# Altium schematic sheet DE-110817_02.SchDoc: Digital & Analog IO
size A3; Author: eldar6776@hotmail.com; DrawnBy: Eldar Dedic; Organization: I-MEDIA GROUP d.o.o.; Address1: Topal Osman Paše 18; Address2: 71000 Sarajevo; Address3: Federacija BiH; Address4: Bosna i Hercegovina; DocumentNumber: DE-110717; Revision: 001
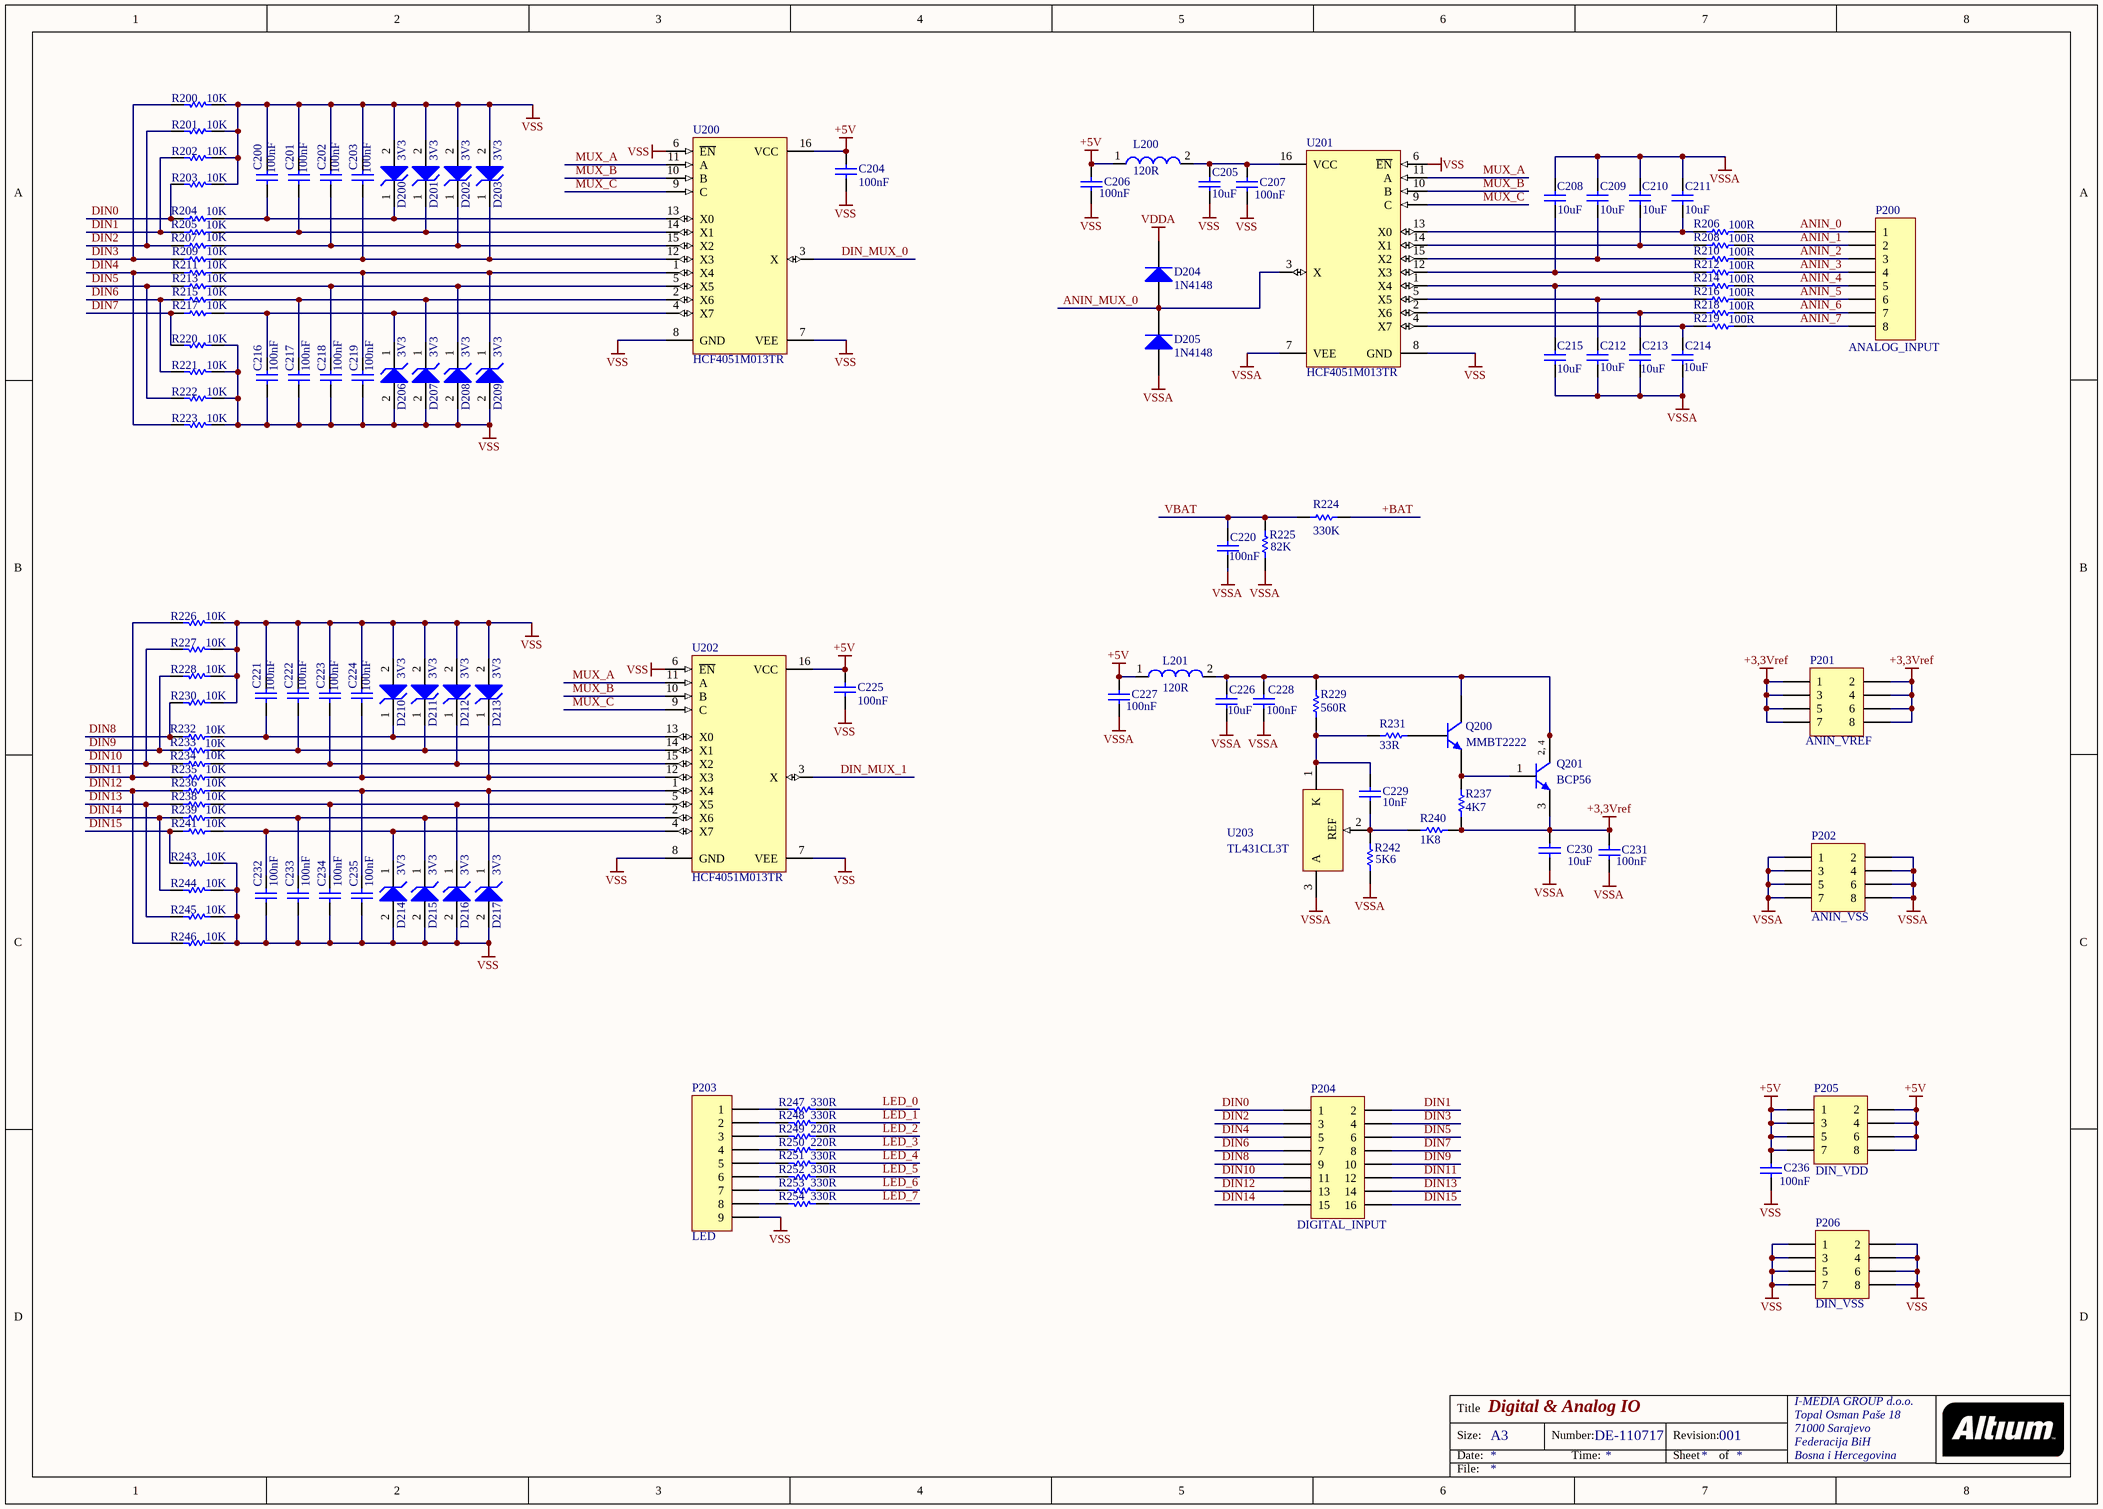
[diagram p0: DE-110817_02.SchDoc]

## Parts
C200  100nF  [0603]
C201  100nF  [0603]
C202  100nF  [0603]
C203  100nF  [0603]
C204  100nF  [0603]
C205  10uF  [0805]
C206  100nF  [0603]
C207  100nF  [0603]
C208  10uF  [0805]
C209  10uF  [0805]
C210  10uF  [0805]
C211  10uF  [0805]
C212  10uF  [0805]
C213  10uF  [0805]
C214  10uF  [0805]
C215  10uF  [0805]
C216  100nF  [0603]
C217  100nF  [0603]
C218  100nF  [0603]
C219  100nF  [0603]
C220  100nF  [0603]
C221  100nF  [0603]
C222  100nF  [0603]
C223  100nF  [0603]
C224  100nF  [0603]
C225  100nF  [0603]
C226  10uF  [0805]
C227  100nF  [0603]
C228  100nF  [0603]
C229  10nF  [0603]
C230  10uF  [0805]
C231  100nF  [0603]
C232  100nF  [0603]
C233  100nF  [0603]
C234  100nF  [0603]
C235  100nF  [0603]
C236  100nF  [0603]
D200  3V3  [ONSC-SOD-323-2-477-02_V]
D201  3V3  [ONSC-SOD-323-2-477-02_V]
D202  3V3  [ONSC-SOD-323-2-477-02_V]
D203  3V3  [ONSC-SOD-323-2-477-02_V]
D204  1N4148  [SOD323]
D205  1N4148  [SOD323]
D206  3V3  [ONSC-SOD-323-2-477-02_V]
D207  3V3  [ONSC-SOD-323-2-477-02_V]
D208  3V3  [ONSC-SOD-323-2-477-02_V]
D209  3V3  [ONSC-SOD-323-2-477-02_V]
D210  3V3  [ONSC-SOD-323-2-477-02_V]
D211  3V3  [ONSC-SOD-323-2-477-02_V]
D212  3V3  [ONSC-SOD-323-2-477-02_V]
D213  3V3  [ONSC-SOD-323-2-477-02_V]
D214  3V3  [ONSC-SOD-323-2-477-02_V]
D215  3V3  [ONSC-SOD-323-2-477-02_V]
D216  3V3  [ONSC-SOD-323-2-477-02_V]
D217  3V3  [ONSC-SOD-323-2-477-02_V]
L200  120R  [SMD-0805]
L201  120R  [SMD-0805]
P200  ANALOG_INPUT  [HDR1X8]
P201  ANIN_VREF  [HDR2X4]
P202  ANIN_VSS  [HDR2X4]
P203  LED  [HDR1X9]
P204  DIGITAL_INPUT  [HDR2X8]
P205  DIN_VDD  [HDR2X4]
P206  DIN_VSS  [HDR2X4]
Q200  MMBT2222  [318-08]
Q201  BCP56  [SOT223_N]
R200  10K  [ERA-0603]
R201  10K  [ERA-0603]
R202  10K  [ERA-0603]
R203  10K  [ERA-0603]
R204  10K  [ERA-0603]
R205  10K  [ERA-0603]
R206  100R  [ERA-0603]
R207  10K  [ERA-0603]
R208  100R  [ERA-0603]
R209  10K  [ERA-0603]
R210  100R  [ERA-0603]
R211  10K  [ERA-0603]
R212  100R  [ERA-0603]
R213  10K  [ERA-0603]
R214  100R  [ERA-0603]
R215  10K  [ERA-0603]
R216  100R  [ERA-0603]
R217  10K  [ERA-0603]
R218  100R  [ERA-0603]
R219  100R  [ERA-0603]
R220  10K  [ERA-0603]
R221  10K  [ERA-0603]
R222  10K  [ERA-0603]
R223  10K  [ERA-0603]
R224  330K  [ERA-0603]
R225  82K  [ERA-0603]
R226  10K  [ERA-0603]
R227  10K  [ERA-0603]
R228  10K  [ERA-0603]
R229  560R  [ERA-0603]
R230  10K  [ERA-0603]
R231  33R  [ERA-0603]
R232  10K  [ERA-0603]
R233  10K  [ERA-0603]
R234  10K  [ERA-0603]
R235  10K  [ERA-0603]
R236  10K  [ERA-0603]
R237  4K7  [ERA-0603]
R238  10K  [ERA-0603]
R239  10K  [ERA-0603]
R240  1K8  [ERA-0603]
R241  10K  [ERA-0603]
R242  5K6  [ERA-0603]
R243  10K  [ERA-0603]
R244  10K  [ERA-0603]
R245  10K  [ERA-0603]
R246  10K  [ERA-0603]
R247  330R  [ERA-0603]
R248  330R  [ERA-0603]
R249  220R  [ERA-0603]
R250  220R  [ERA-0603]
R251  330R  [ERA-0603]
R252  330R  [ERA-0603]
R253  330R  [ERA-0603]
R254  330R  [ERA-0603]
U200  HCF4051M013TR  [M16A_N]
U201  HCF4051M013TR  [M16A_N]
U202  HCF4051M013TR  [M16A_N]
U203  TL431CL3T  [SOT23-3_N]

## Nets
+3,3Vref: C230.2 C231.2 P201.1 P201.2 P201.3 P201.4 P201.5 P201.6 P201.7 P201.8 Q201.3(E) R237.2 R240.2
+5V: C204.2 C206.2 C225.2 C227.2 C236.2 L200.1 L201.1 P205.1 P205.2 P205.3 P205.4 P205.5 P205.6 P205.7 P205.8 U200.16(VCC) U202.16(VCC)
VDDA: D204.1(K)
VSS: C200.1 C201.1 C202.1 C203.1 C204.1 C205.1 C206.1 C207.1 C216.1 C217.1 C218.1 C219.1 C221.1 C222.1 C223.1 C224.1 C225.1 C232.1 C233.1 C234.1 C235.1 C236.1 D200.2(A) D201.2(A) D202.2(A) D203.2(A) D206.2(A) D207.2(A) D208.2(A) D209.2(A) D210.2(A) D211.2(A) D212.2(A) D213.2(A) D214.2(A) D215.2(A) D216.2(A) D217.2(A) P203.9 P206.1 P206.2 P206.3 P206.4 P206.5 P206.6 P206.7 P206.8 R200.1 R201.1 R202.1 R203.1 R220.1 R221.1 R222.1 R223.1 R226.1 R227.1 R228.1 R230.1 R243.1 R244.1 R245.1 R246.1 U200.6(~{EN}) U200.7(VEE) U200.8(GND) U201.6(~{EN}) U201.8(GND) U202.6(~{EN}) U202.7(VEE) U202.8(GND)
VSSA: C208.1 C209.1 C210.1 C211.1 C212.1 C213.1 C214.1 C215.1 C220.1 C226.1 C227.1 C228.1 C230.1 C231.1 D205.2(A) P202.1 P202.2 P202.3 P202.4 P202.5 P202.6 P202.7 P202.8 R225.1 R242.2 U201.7(VEE) U203.3(A)
+BAT: R224.2
ANIN_0: P200.1 R206.2
ANIN_1: P200.2 R208.2
ANIN_2: P200.3 R210.2
ANIN_3: P200.4 R212.2
ANIN_4: P200.5 R214.2
ANIN_5: P200.6 R216.2
ANIN_6: P200.7 R218.2
ANIN_7: P200.8 R219.2
ANIN_MUX_0: D204.2(A) D205.1(K) U201.3(X)
DIN0: P204.1 R203.2 R204.1
DIN1: P204.2 R202.2 R205.1
DIN2: P204.3 R201.2 R207.1
DIN3: P204.4 R200.2 R209.1
DIN4: P204.5 R211.1 R223.2
DIN5: P204.6 R213.1 R222.2
DIN6: P204.7 R215.1 R221.2
DIN7: P204.8 R217.1 R220.2
DIN8: P204.9 R230.2 R232.1
DIN9: P204.10 R228.2 R233.1
DIN10: P204.11 R227.2 R234.1
DIN11: P204.12 R226.2 R235.1
DIN12: P204.13 R236.1 R246.2
DIN13: P204.14 R238.1 R245.2
DIN14: P204.15 R239.1 R244.2
DIN15: P204.16 R241.1 R243.2
DIN_MUX_0: U200.3(X)
DIN_MUX_1: U202.3(X)
LED_0: R247.2
LED_1: R248.2
LED_2: R249.2
LED_3: R250.2
LED_4: R251.2
LED_5: R252.2
LED_6: R253.2
LED_7: R254.2
MUX_A: U200.11(A) U201.11(A) U202.11(A)
MUX_B: U200.10(B) U201.10(B) U202.10(B)
MUX_C: U200.9(C) U201.9(C) U202.9(C)
VBAT: C220.2 R224.1 R225.2
NetC200_2: C200.2 D200.1(K) R204.2 U200.13(X0)
NetC201_2: C201.2 D201.1(K) R205.2 U200.14(X1)
NetC202_2: C202.2 D202.1(K) R207.2 U200.15(X2)
NetC203_2: C203.2 D203.1(K) R209.2 U200.12(X3)
NetC205_2: C205.2 C207.2 L200.2 U201.16(VCC)
NetC208_2: C208.2 R212.1 U201.12(X3)
NetC209_2: C209.2 R210.1 U201.15(X2)
NetC210_2: C210.2 R208.1 U201.14(X1)
NetC211_2: C211.2 R206.1 U201.13(X0)
NetC212_2: C212.2 R216.1 U201.5(X5)
NetC213_2: C213.2 R218.1 U201.2(X6)
NetC214_2: C214.2 R219.1 U201.4(X7)
NetC215_2: C215.2 R214.1 U201.1(X4)
NetC216_2: C216.2 D206.1(K) R217.2 U200.4(X7)
NetC217_2: C217.2 D207.1(K) R215.2 U200.2(X6)
NetC218_2: C218.2 D208.1(K) R213.2 U200.5(X5)
NetC219_2: C219.2 D209.1(K) R211.2 U200.1(X4)
NetC221_2: C221.2 D210.1(K) R232.2 U202.13(X0)
NetC222_2: C222.2 D211.1(K) R233.2 U202.14(X1)
NetC223_2: C223.2 D212.1(K) R234.2 U202.15(X2)
NetC224_2: C224.2 D213.1(K) R235.2 U202.12(X3)
NetC226_2: C226.2 C228.2 L201.2 Q200.3(C) Q201.2(C) Q201.4(C) R229.2
NetC229_1: C229.1 R229.1 R231.2 U203.1(K)
NetC229_2: C229.2 R240.1 R242.1 U203.2(REF)
NetC232_2: C232.2 D214.1(K) R241.2 U202.4(X7)
NetC233_2: C233.2 D215.1(K) R239.2 U202.2(X6)
NetC234_2: C234.2 D216.1(K) R238.2 U202.5(X5)
NetC235_2: C235.2 D217.1(K) R236.2 U202.1(X4)
NetP203_1: P203.1 R247.1
NetP203_2: P203.2 R248.1
NetP203_3: P203.3 R249.1
NetP203_4: P203.4 R250.1
NetP203_5: P203.5 R251.1
NetP203_6: P203.6 R252.1
NetP203_7: P203.7 R253.1
NetP203_8: P203.8 R254.1
NetQ200_1: Q200.1(B) R231.1
NetQ200_2: Q200.2(E) Q201.1(B) R237.1

## Notes on the sheet
- Title
- Size:
- Date:
- A3
- Number:
- Time:
- Revision:
- Sheet
- of
- File:
- (in symbol BCP56) 2, 4

## Library data of the parts
C200-C204 C206 C207 C216-C225 C227-C229 C231-C236 = C0603: Ceramic Chip Capacitor - Standard; Note: Footprint corresponds to dimensions for bulk cassette packaging. This case size has tightened tolerances.; Published: 17-Jul-2002; LatestRevisionDate: 19-Mar-2004; LatestRevisionNote: Silkscreen size reduced.; DatasheetDocument: Mar-2001; PackageDocument: Mar-2001; PackageReference: 0603; Publisher: Altium Limited; Code_JEITA: 0603; Code_IPC: 1608 [0603]; ComponentLink1Description: Manufacturer Link; ComponentLink1URL: http://www.kemet.com/; ComponentLink2Description: Datasheet; ComponentLink2URL: http://www.kemet.com/kemet/web/homepage/kechome.nsf/vapubfilesname/F3102TA.pdf/$file/F3102TA.pdf
  C204 C206 C207 C225 C227 C228 C231 C236: Value: 100nF
  C229: Value: 10nF
C205 C208-C215 C226 C230 = C0805: Ceramic Chip Capacitor - Standard; Note: Footprint corresponds to dimensions for bulk cassette packaging. This case size has tightened tolerances.; Published: 17-Jul-2002; LatestRevisionDate: 19-Mar-2004; LatestRevisionNote: Silkscreen size reduced.; DatasheetDocument: Mar-2001; PackageDocument: Mar-2001; PackageReference: 0805; Publisher: Altium Limited; Code_JEITA: 0805; Code_IPC: 2012[0805]; ComponentLink1Description: Manufacturer Link; ComponentLink1URL: http://www.kemet.com/; ComponentLink2Description: Datasheet; ComponentLink2URL: http://www.kemet.com/kemet/web/homepage/kechome.nsf/vapubfilesname/F3102TA.pdf/$file/F3102TA.pdf; Value: 10uF
D200-D203 D206-D217 = MM3Z33VT1G: Zener Voltage Regulator, 300 mW, 2-Pin SOD-323, Pb-Free, Tape and Reel; Manufacturer: On Semiconductor; P Max (W): 0.3; VZ Typ (V): 33; DatasheetVersion: Rev. 9; PackageVersion: Rev. H, 03/2007; PackageReference: SOD-323-2-477-02; PackageDescription: 2-Pin SOD, Body 1.7 x 1.25 mm; Supplier 1: Digi-Key; Supplier Part Number 1: MM3Z33VT1GOSTR-ND; Supplier 2: Digi-Key; Supplier Part Number 2: MM3Z33VT1GOSCT-ND; Supplier 3: Digi-Key; Supplier Part Number 3: MM3Z33VT1GOSDKR-ND; Supplier 4: Farnell; Supplier Part Number 4: 1431197RL; Supplier 5: Farnell; Supplier Part Number 5: 1431197; Supplier 6: Newark; Supplier Part Number 6: 98H0837; Supplier 7: Mouser; Supplier Part Number 7: 863-MM3Z33VT1G; Packing: Tape and Reel; RoHS: Pb-Free; Mounting Technology: Surface Mount; PartNumber: MM3Z33VT1G; ComponentLink1Description: Manufacturer URL; ComponentLink1URL: http://www.onsemi.com/; ComponentLink2Description: Datasheet; ComponentLink2URL: http://www.onsemi.cn/pub_link/Collateral/MM3Z2V4T1-D.PDF; ComponentLink3Description: Package Specification; ComponentLink3URL: http://www.onsemi.com/pub_link/Collateral/477-02.PDF.1
D204 D205 = BAS321: General-purpose Diode; Published: 17-Sep-2003; LatestRevisionDate: 19-Mar-2004; LatestRevisionNote: Silkscreen size reduced.; DatasheetVersion: 9-Feb-1999; PackageVersion: May-1999; PackageReference: SOD323; Publisher: Altium Limited; PackageDescription: SOD-323/SC-76; 2 Leads; Body 1.7 x 1.3 mm, (LxW); ComponentLink1Description: Manufacturer Link; ComponentLink1URL: http://www.semiconductors.philips.com/; ComponentLink2Description: Datasheet; ComponentLink2URL: http://www.semiconductors.philips.com/acrobat/datasheets/BAS321_2.pdf
L200 L201 = 74279202: SMD EMI Suppression Ferrite Bead WE-CBF, Z = 120 Ohm; Impedance: 120 Ohm; DatasheetVersion: Dec-2005; PackageReference: SMD-0805; PackageDescription: Chip Inductor, 2-Leads, Body 2.0 x 1.2 mm; PartNumber: 74279202; ComponentLink1Description: Manufacturer URL; ComponentLink1URL: http://www.we-online.com; ComponentLink2Description: Datasheet; ComponentLink2URL: http://www.we-online.de/katalog/media/pdf/74279202.pdf
P200 = Header 8: Header, 8-Pin; LatestRevisionDate: 17-Jul-2002; LatestRevisionNote: Re-released for DXP Platform.; Publisher: Altium Limited
P201 P202 P205 P206 = Header 4X2: Header, 4-Pin, Dual row; LatestRevisionDate: 17-Jul-2002; LatestRevisionNote: Re-released for DXP Platform.; Publisher: Altium Limited
P203 = Header 9: Header, 9-Pin; LatestRevisionDate: 17-Jul-2002; LatestRevisionNote: Re-released for DXP Platform.; Publisher: Altium Limited
P204 = Header 8X2: Header, 8-Pin, Dual row; LatestRevisionDate: 17-Jul-2002; LatestRevisionNote: Re-released for DXP Platform.; Publisher: Altium Limited
Q200 = MMBT2222ALT1: General Purpose Transistor NPN Silicon; Published: 29-Sep-2000; LatestRevisionDate: 17-Jul-2002; LatestRevisionNote: Re-released for DXP Platform.; DatasheetVersion: 1996; PackageVersion: 1997; PackageReference: 318-08; Publisher: Altium Limited; PackageDescription: SOT-23; 3 Leads; Body 3.0 x 2.6 mm, inc. leads (LxW max); ComponentLink1Description: Manufacturer Link; ComponentLink1URL: http://www.onsemi.com/site/products/landing?taxonomyID=194; ComponentLink2Description: Datasheet; ComponentLink2URL: http://www.onsemi.com/pub/Collateral/MMBT2222LT1-D.PDF
Q201 = BCP56: NPN Medium Power Transistor; Published: 17-Sep-2003; LatestRevisionDate: 12-Dec-2006; LatestRevisionNote: IPC-7351 Footprint Added.; DatasheetVersion: 10-Oct-2001; PackageVersion: Aug-2001; PackageReference: SOT223; Publisher: Altium Limited; PackageDescription: 4-Pin SOT-223 Package 2.3 mm Pitch, 7 mm Lead Span; ComponentLink1Description: Manufacturer Link; ComponentLink1URL: http://www.semiconductors.philips.com/; ComponentLink2Description: Datasheet; ComponentLink2URL: http://www.semiconductors.philips.com/acrobat/datasheets/BC639_BCP56_BCX56_7.pdf
R200-R254 = ERAV: Metal Film Thermosensitive Chip Resistor, 0.56 Ohm to 10k Ohm Range, 5% Tolerance, 0603 Size, 0.063 W; Note: If flow soldering, adjust pad width of PCB Footprint to 0.7 - 0.8 times the width of the resistor.; Published: 17-Dec-2003; LatestRevisionDate: 19-Mar-2004; LatestRevisionNote: Silkscreen size reduced.; PackageDocument: Mar-2003; PackageReference: ERA-0603; Publisher: Altium Limited; Code_IPC: 1608 [0603]; ComponentLink1Description: Manufacturer Link; ComponentLink1URL: http://www.panasonic.com/industrial/components/resistive_products.htm; ComponentLink2Description: Datasheet; ComponentLink2URL: http://www.panasonic.com/industrial/components/pdf/AOF0000CE1.pdf
U200-U202 = CD4051BCM: 8-Channel Analog Multiplexer/Demultiplexer; Published: 17-Jul-2002; LatestRevisionDate: 13-Apr-2006; LatestRevisionNote: IPC-7351 Footprint Added.; DatasheetVersion: Jan-1999; PackageVersion: 2000; PackageReference: M16A; Publisher: Altium Limited; PackageDescription: 16-Pin Small Outline Integrated Circuit 1.27 mm Pitch; Code_IPC: SOIC127P600-16; ComponentLink1Description: Manufacturer Link; ComponentLink1URL: http://www.fairchildsemi.com/; ComponentLink2Description: Datasheet; ComponentLink2URL: http://www.fairchildsemi.com/ds/CD%2FCD4052BC.pdf
U203 = TL431CL3T: Programmable Voltage Reference, 2.5 to 36V, 3-Pin SOT23-3, Tape and Reel; DatasheetVersion: Oct-2011; PackageVersion: 2011; PackageReference: SOT23-3; PackageDescription: 3-Pin SOT-23 Package 0.95 mm Pitch, 2.4 mm Lead Span; ComponentLink1Description: Manufacturer URL; ComponentLink1URL: http://www.st.com; ComponentLink2Description: Datasheet; ComponentLink2URL: http://www.st.com/internet/com/TECHNICAL_RESOURCES/TECHNICAL_LITERATURE/DATASHEET/CD00000986.pdf